# Altium project Pira_Smart_RS485_Addon.PrjPCB
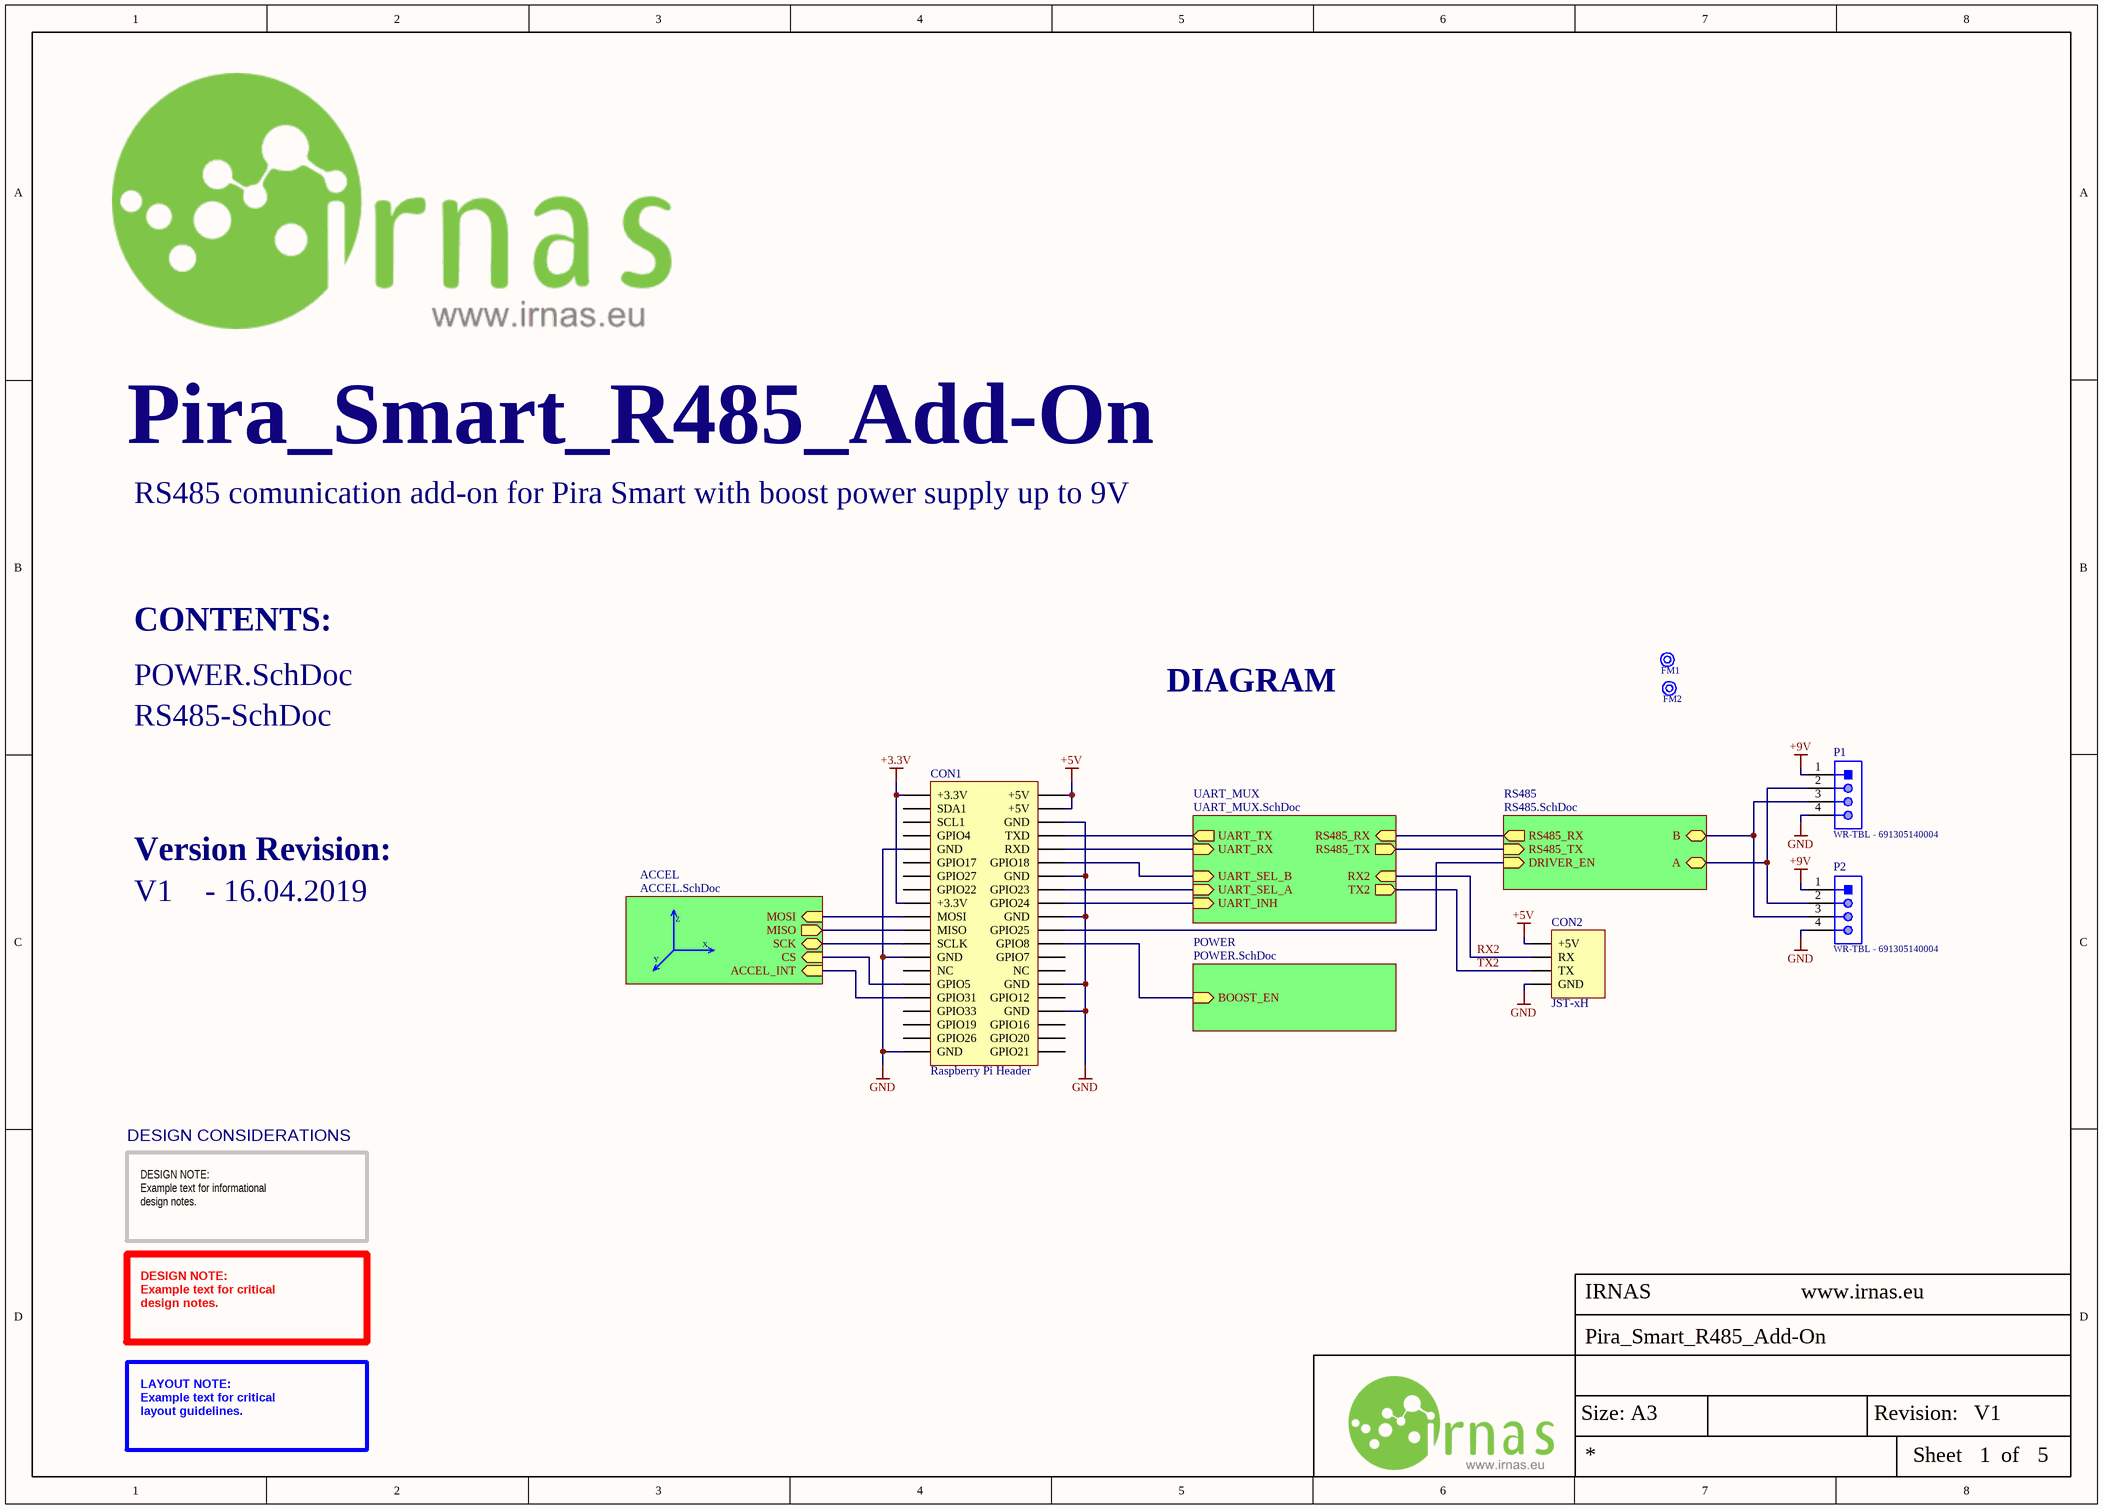
[diagram p0: MAIN.SchDoc]
Company: IRNAS; CreateDate: 16.04.2019; PCBDesigner: Aleksej Cegner; ProjectTitle: Pira_Smart_R485_Add-On; RevisionDate: 16.04.2019; Version: V1; Website: www.irnas.eu
5 sheets, 53 parts. Net scope: hierarchical (ports join the sheet entries above them; power ports are global).
Board file: Pira-Smart-RS485-Addon.PcbDoc
Sheets:
  MAIN.SchDoc
    POWER = POWER.SchDoc
    RS485 = RS485.SchDoc
    UART_MUX = UART_MUX.SchDoc
    ACCEL = ACCEL.SchDoc

## Sheet MAIN.SchDoc
size A3; DocumentNumber: 1; SheetNumber: 1; SheetTotal: 5

### Parts
CON1  Raspberry Pi Header  [HDR2X20]
CON2  JST-xH  [JST-xH]
FM1  FIDUCAL MARKER  [FIDUCAL]  (value not drawn)
FM2  FIDUCAL MARKER  [FIDUCAL]  (value not drawn)
P1  WR-TBL - 691305140004  [691305140004]
P2  WR-TBL - 691305140004  [691305140004]

### Sub-sheets
ACCEL = ACCEL.SchDoc: CS (in), MISO (out), ACCEL_INT (in), SCK (bidir), MOSI (in)
POWER = POWER.SchDoc: BOOST_EN (in)
RS485 = RS485.SchDoc: DRIVER_EN (in), B (bidir), A (bidir), RS485_RX (out), RS485_TX (in)
UART_MUX = UART_MUX.SchDoc: UART_TX (out), UART_SEL_A (in), UART_SEL_B (in), UART_INH (in), RS485_TX (out), RX2 (in), TX2 (out), UART_RX (in), RS485_RX (in)

### Nets
+3.3V: CON1.1(+3.3V) CON1.17(+3.3V)
+5V: CON1.2(+5V) CON1.4(+5V) CON2.1(+5V)
+9V: P1.1 P2.1
GND: CON1.6(GND) CON1.9(GND) CON1.14(GND) CON1.20(GND) CON1.25(GND) CON1.30(GND) CON1.34(GND) CON1.39(GND) CON2.4(GND) P1.4 P2.4
A: P1.2 P2.2 ; sheet RS485/A
ACCEL_INT: CON1.31(GPIO31) ; sheet ACCEL/ACCEL_INT
B: P1.3 P2.3 ; sheet RS485/B
BOOST_EN: CON1.24(GPIO8) ; sheet POWER/BOOST_EN
CS: CON1.29(GPIO5) ; sheet ACCEL/CS
DRIVER_EN: CON1.22(GPIO25) ; sheet RS485/DRIVER_EN
MISO: CON1.21(MISO) ; sheet ACCEL/MISO
MOSI: CON1.19(MOSI) ; sheet ACCEL/MOSI
RS485_RX: sheet RS485/RS485_RX, sheet UART_MUX/RS485_RX
RS485_TX: sheet RS485/RS485_TX, sheet UART_MUX/RS485_TX
RX2: CON2.2(RX) ; sheet UART_MUX/RX2
SCK: CON1.23(SCLK) ; sheet ACCEL/SCK
TX2: CON2.3(TX) ; sheet UART_MUX/TX2
UART_INH: CON1.18(GPIO24) ; sheet UART_MUX/UART_INH
UART_RX: CON1.10(RXD) ; sheet UART_MUX/UART_RX
UART_SEL_A: CON1.16(GPIO23) ; sheet UART_MUX/UART_SEL_A
UART_SEL_B: CON1.12(GPIO18) ; sheet UART_MUX/UART_SEL_B
UART_TX: CON1.8(TXD) ; sheet UART_MUX/UART_TX

Not connected (* = marked no-connect by the designer): CON1 3(SDA1) 5(SCL1) 7(GPIO4) 11(GPIO17) 13(GPIO27) 15(GPIO22) 26(GPIO7) 27(NC) 28(NC) 32(GPIO12) 33(GPIO33) 35(GPIO19) 36(GPIO16) 37(GPIO26) 38(GPIO20) 40(GPIO21)

### Notes on the sheet
- RS485 comunication add-on for Pira Smart with boost power supply up to 9V
- CONTENTS:
- POWER.SchDoc
- DIAGRAM
- RS485-SchDoc
- Version Revision:
- V1    - 16.04.2019
- Z
- Y
- X
- DESIGN CONSIDERATIONS
- DESIGN NOTE:
  Example text for informational
  design notes.
- DESIGN NOTE:
  Example text for critical
  design notes.
- LAYOUT NOTE:
  Example text for critical
  layout guidelines.
- Size: A3
- Revision:
- Sheet
- of

### Library data of the parts
CON1 = Raspberry Pi Header: Header, 20-Pin, Dual row; LatestRevisionDate: 17-Jul-2002; LatestRevisionNote: Re-released for DXP Platform.; Publisher: Altium Limited
CON2 = B4B-XH-A(LF)(SN): 4 Positions Header, Shrouded Connector 0.098" (2.50mm) Through Hole Tin; Manufacturer: JST; No of Positions: 4; Pitch: 2.5 mm; Style/Orientation: Straight Header/Plug; Voltage Rating: 250 V; Current Rating: 3 A; No of Rows: 1; Gender: Male; Mating Type: Detent Lock; Insulation Resistance: 1000 MΩ; Supplier 1: Farnell; Manufacturer Part Number: B4B-XH-A(LF)(SN); Stock 1: 0; Termination: Crimp; Operating Temp Range: -25 to +85 °C; Contact Material: Brass; Contact Plating: Tin; Material: Polyamide; Type: Shrouded Header; Color: Natural; ComponentLink1URL: https://datasheet.ciiva.com/26894/getdatasheetpartid-455616-26894787.pdf; ComponentLink1Description: https://datasheet.ciiva.com/26894/getdatasheetpartid-455616-26894787.pdf; ComponentLink2URL: https://datasheet.ciiva.com/26924/getdatasheetpartid-640571-26924035.pdf; ComponentLink2Description: https://datasheet.ciiva.com/26924/getdatasheetpartid-640571-26924035.pdf; ComponentLink3URL: https://datasheet.ciiva.com/16203/b4b-xh-alfsn-16203642.pdf; ComponentLink3Description: https://datasheet.ciiva.com/16203/b4b-xh-alfsn-16203642.pdf; ComponentLink4URL: https://datasheet.ciiva.com/726/exh-726404.pdf; ComponentLink4Description: https://datasheet.ciiva.com/726/exh-726404.pdf; Supplier Part Number 1: 1516278
FM1 FM2 = FIDUCAL: Komp / Device: SMD; FIT: 0.94; ComponentLink1Description: Datasheet
P1 P2 = WR-TBL - 691305140004: Serie 3051 - 3.50mm Horizontal PCB Header with Plastic Latch WR-TBL, 4 pin; Pin Number: 4; Gender: Male; ComponentLink1Description: Manufacturer; ComponentLink1URL: http://www.we-online.de; ComponentLink2Description: Datasheet; ComponentLink2URL: http://katalog.we-online.de/em/datasheet/691305140004.pdf; Part Number: 691305140004; Published Date: June 2018; Publisher: Wurth Elektronik; Pitch: 3.50 mm; Operating Temperature: -40 to 105 degC; Mounting Technology: THT; Packaging: Box

## Sheet POWER.SchDoc
size A3; DocumentNumber: 2; SheetNumber: 2; SheetTotal: 5
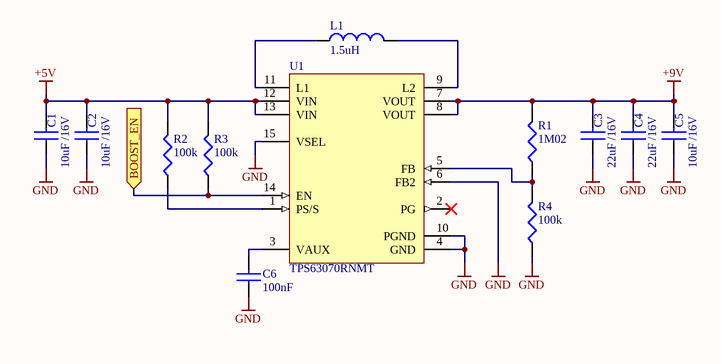
[diagram p1: POWER.SchDoc]

### Parts
C1  10uF /16V  [CAP0805]
C2  10uF /16V  [CAP0805]
C3  22uF /16V  [CAP0805]
C4  22uF /16V  [CAP0805]
C5  10uF /16V  [CAP0805]
C6  100nF  [CAP0603]
L1  1.5uH  [FDSD0402]
R1  1M02  [RES0603]
R2  100k  [RES0603]
R3  100k  [RES0603]
R4  100k  [RES0603]
U1  TPS63070RNMT  [VQFN TPS]

### Ports
BOOST_EN (in)

### Nets
+5V: C1.2 C2.2 R2.2 R3.2 U1.12(VIN) U1.13(VIN)
+9V: C3.2 C4.2 C5.2 R1.2 U1.7(VOUT) U1.8(VOUT)
GND: C1.1 C2.1 C3.1 C4.1 C5.1 C6.1 R4.1 U1.4(GND) U1.6(FB2) U1.10(PGND) U1.15(VSEL)
BOOST_EN: R3.1 U1.14(EN) ; port BOOST_EN
NetC6_2: C6.2 U1.3(VAUX)
NetL1_1: L1.1 U1.11(L1)
NetL1_2: L1.2 U1.9(L2)
NetR1_1: R1.1 R4.2 U1.5(FB)
NetR2_1: R2.1 U1.1(PS/S)

Not connected (* = marked no-connect by the designer): U1 2(PG)*

### Notes on the sheet
- Size: A3
- Revision:
- Sheet
- of

### Library data of the parts
C1 C2 C5 = C - 10uF /16V: TDK - CGA4J1X5R1C106K125AC - CAP, MLCC, X5R, 10UF, 16V, 0805; Supplier 1: Farnell; Manufacturer: TDK; Manufacturer Part Number: CGA4J1X5R1C106K125AC; RoHS: YES; Stock 1: 8974; Pricing 1: 5=0.41, 50=0.146, 250=0.131, 500=0.12, 1000=0.103 (GBP); ComponentLink1URL: http://bcove.me/e1v54mtm; ComponentLink1Description: http://bcove.me/e1v54mtm; ComponentLink2URL: http://www.farnell.com/datasheets/1936565.pdf; ComponentLink2Description: http://www.farnell.com/datasheets/1936565.pdf; ComponentLink3URL: http://www.farnell.com/datasheets/1683658.pdf; ComponentLink3Description: http://www.farnell.com/datasheets/1683658.pdf; Supplier Part Number 1: 2210948RL
C3 C4 = C - 22u 6.3V 0805: MULTICOMP - MC0805X226M6R3CT - CAP, MLCC, X5R, 22UF, 0805; Ceramic Capacitor Case: 0805 [2012 Metric]; Capacitance: 22; Voltage Rating: 6.3; Capacitance Tolerance: ± 20%; Dielectric Characteristic: X5; Product Range: MC Series; SVHC: No SVHC (07-Jul-2017); Capacitor Terminals: SMD; Supplier 1: Farnell; Manufacturer: MULTICOMP; Manufacturer Part Number: MC0805X226M6R3CT; RoHS: YES; Stock 1: 74736; Pricing 1: 5=0.128, 50=0.0738, 250=0.0507, 500=0.042, 1500=0.0358 (GBP); Packaging: Cut Tape; Operating Temperature Min: -55; Operating Temperature Max: 85; Automotive Qualification Standard: -; MSL: -; Capacitance Tolerance ±: ± 20%; Operating Temperature Range: -55°C to +85°C<!--FANDB--><div class="features-and-benefits-container"><div class="features-and-benefits-desc-container"><span class="features-and-benefits-container-desc">SMD Multilayer Ceramic Capacitor, 0805 [2012 Metric], 22 µF, 6.3 V, ± 20%, X5R, MC Series</span></div><div class="features-and-benefits-description"><span class="features-benefits-value">The Multicomp MC series is general purpose MLCC capacitors with X5R dielectric material which provides high electrical precision, stability and reliability. This MLCC capacitor consists of a conducting material and electrodes with high density and high efficiency ceramic condensers.</span></div><div class="features-and-benefits-list"><ul class="features-and-benefits-list-list"><li class="features-and-benefits-list-item">Small size with higher capacitance values</li><li class="features-and-benefits-list-item">0201, 0402, 0603, 0805, 1206, 1210, 1812 case sizes available</li><li class="features-and-benefits-list-item">Capacitance value ranging from 100pF to 220?F</li><li class="features-and-benefits-list-item">Capacitor with lead free termination (pure Tin)</li><li class="features-and-benefits-list-item">High electrical precision, stability and reliability</li><li class="features-and-benefits-list-item">Rated voltage of 4V, 6.3V, 10V, 16V, 25V, 50V</li><li class="features-and-benefits-list-item">Operating temperature of -55°C to +85°C</li><li class="features-and-benefits-list-item">Available in ±10% and ±20; ComponentLink1URL: http://www.farnell.com/datasheets/1901289.pdf; ComponentLink1Description: http://www.farnell.com/datasheets/1901289.pdf; ComponentLink2URL: http://www.farnell.com/datasheets/1932399.pdf; ComponentLink2Description: http://www.farnell.com/datasheets/1932399.pdf; Supplier Part Number 1: 1759415
C6 = C - 100nF: MURATA - GRM188R71C104KA01J - CAP, MLCC, X7R, 0.1UF, 16V, 0603; IRNAS Part No.: I-200005; Ceramic Capacitor Case: 0603 [1608 Metric]; Capacitance: 0.1; Voltage Rating: 16; Capacitance Tolerance: ± 10%; Dielectric Characteristic: X7; Product Range: GRM Series; SVHC: No SVHC (20-Jun-2016; Supplier 1: Farnell; Manufacturer: MURATA; Manufacturer Part Number: GRM188R71C104KA01J; RoHS: YES; Stock 1: 18297; Pricing 1: 10=0.0145, 100=0.0126, 500=0.0081, 2500=0.0059, 5000=0.0052, 10000=0.0046, 50000=0.0036, 100000=0.0035 (GBP); Packaging: Cut Tape; Operating Temperature Min: -55; Operating Temperature Max: 125; Automotive Qualification Standard: -; MSL: MSL 1 - Unlimited; ComponentLink1URL: http://www.farnell.com/datasheets/2189124.pdf; ComponentLink1Description: http://www.farnell.com/datasheets/2189124.pdf; Supplier Part Number 1: 2688519
L1 = L - 1.5uH 5.1A: MURATA - FDSD0420-H-1R5M=P3 - INDUCTOR, SHIELDED, 1.5UH, 5.1A, 20%; Product Range: FDSD0420 Series; Inductance: 1.5; RMS Current (Irms): 5.1; Saturation Current (Isat): 7.7; DC Resistance Max: 0.036; Power Inductor Case: 4.2mm x 4.2mm x 2; SVHC: No SVHC (17-Dec-2015); Supplier 1: Farnell; Manufacturer: MURATA; Manufacturer Part Number: FDSD0420-H-1R5M=P3; RoHS: YES; Stock 1: 1471; Pricing 1: 5=0.79, 50=0.448, 250=0.422, 500=0.377, 1000=0.305, 2000=0.298, 10000=0.291, 20000=0.284 (GBP); Inductor Construction: Shielded; Inductance Tolerance: ± 20%; Packaging: Each; MSL: MSL 1 - Unlimited<!--FANDB--><div class="features-and-benefits-container"></div>; ComponentLink1URL: http://www.farnell.com/datasheets/2021980.pdf; ComponentLink1Description: http://www.farnell.com/datasheets/2021980.pdf; Supplier Part Number 1: 2530091
R1 = R - 100k: MULTICOMP - MCMR06X104 JTL - RES, CERAMIC, 1M02, 1%, 0.1W, 0603; Resistance: 100; Voltage Rating: 75; Resistor Case Style: 0603 [1608 Metric]; Product Range: MCMR Series; Temperature Coefficient: ± 100; Resistor Mounting: Surface Mount Device<!--FANDB--><div class="features-and-benefits-container"><div class="features-and-benefits-description"><span class="features-benefits-value">The Multicomp MCMR series resistors are automotive grade, anti sulphured thick film chip resistor. The resistance range includes E24 and E96 decade values from 1ohm to 10Mohm. These resistors are constructed on top of a high grade ceramic body.</span></div><div class="features-and-benefits-list"><ul class="features-and-benefits-list-list"><li class="features-and-benefits-list-item">EIA 0402, 0603, 0805, 1206 chip sizes available</li><li class="features-and-benefits-list-item">High reliability and stability</li><li class="features-and-benefits-list-item">Automotive grade AEC-Q200 compliant</li><li class="features-and-benefits-list-item">Complaint with (IEC 60068-1) 55/155/56 climatic category</li><li class="features-and-benefits-list-item">Maximum operation voltage of 50V, 75V, 150V and 200V</li><li class="features-and-benefits-list-item">Power rating of 62.5mW, 100mW, 125mW and 250mW</li><li class="features-and-benefits-list-item">Available in ±1% and ±5% tolerance</li><li class="features-and-benefits-list-item">Temperature coefficient (TCR) of +200ppm/°C, +100ppm/°C and -200ppm/°C to +400ppm/°C</li><li class="features-and-benefits-list-item">Operating temperature range -55°C to 155; Supplier 1: Farnell; Manufacturer: MULTICOMP; Manufacturer Part Number: MCMR06X104 JTL; RoHS: Y-EX; Stock 1: 187; Pricing 1: 10=0.0109, 100=0.0085, 500=0.006, 1000=0.0048, 2500=0.004, 5000=0.003, 25000=0.002, 50000=0.0016 (GBP); Power Rating: 100; Resistance Tolerance: ± 1%; Packaging: Cut Tape; Resistor Element Material: Ceramic; Automotive Qualification Standard: -; ComponentLink1URL: http://www.farnell.com/datasheets/1716707.pdf; ComponentLink1Description: http://www.farnell.com/datasheets/1716707.pdf; Supplier Part Number 1: 2073357
R2 R3 = R - 100k: MULTICOMP - MCMR06X104 JTL - RES, CERAMIC, 100K, 5%, 0.1W, 0603; Resistance: 100; Voltage Rating: 75; Resistor Case Style: 0603 [1608 Metric]; Product Range: MCMR Series; Temperature Coefficient: ± 100; Resistor Mounting: Surface Mount Device<!--FANDB--><div class="features-and-benefits-container"><div class="features-and-benefits-description"><span class="features-benefits-value">The Multicomp MCMR series resistors are automotive grade, anti sulphured thick film chip resistor. The resistance range includes E24 and E96 decade values from 1ohm to 10Mohm. These resistors are constructed on top of a high grade ceramic body.</span></div><div class="features-and-benefits-list"><ul class="features-and-benefits-list-list"><li class="features-and-benefits-list-item">EIA 0402, 0603, 0805, 1206 chip sizes available</li><li class="features-and-benefits-list-item">High reliability and stability</li><li class="features-and-benefits-list-item">Automotive grade AEC-Q200 compliant</li><li class="features-and-benefits-list-item">Complaint with (IEC 60068-1) 55/155/56 climatic category</li><li class="features-and-benefits-list-item">Maximum operation voltage of 50V, 75V, 150V and 200V</li><li class="features-and-benefits-list-item">Power rating of 62.5mW, 100mW, 125mW and 250mW</li><li class="features-and-benefits-list-item">Available in ±1% and ±5% tolerance</li><li class="features-and-benefits-list-item">Temperature coefficient (TCR) of +200ppm/°C, +100ppm/°C and -200ppm/°C to +400ppm/°C</li><li class="features-and-benefits-list-item">Operating temperature range -55°C to 155; Supplier 1: Farnell; Manufacturer: MULTICOMP; Manufacturer Part Number: MCMR06X104 JTL; RoHS: Y-EX; Stock 1: 187; Pricing 1: 10=0.0109, 100=0.0085, 500=0.006, 1000=0.0048, 2500=0.004, 5000=0.003, 25000=0.002, 50000=0.0016 (GBP); Power Rating: 100; Resistance Tolerance: ± 5%; Packaging: Cut Tape; Resistor Element Material: Ceramic; Automotive Qualification Standard: -; ComponentLink1URL: http://www.farnell.com/datasheets/1716707.pdf; ComponentLink1Description: http://www.farnell.com/datasheets/1716707.pdf; Supplier Part Number 1: 2073357
R4 = R - 100k: MULTICOMP - MCMR06X104 JTL - RES, CERAMIC, 100K, 1%, 0.1W, 0603; Resistance: 100; Voltage Rating: 75; Resistor Case Style: 0603 [1608 Metric]; Product Range: MCMR Series; Temperature Coefficient: ± 100; Resistor Mounting: Surface Mount Device<!--FANDB--><div class="features-and-benefits-container"><div class="features-and-benefits-description"><span class="features-benefits-value">The Multicomp MCMR series resistors are automotive grade, anti sulphured thick film chip resistor. The resistance range includes E24 and E96 decade values from 1ohm to 10Mohm. These resistors are constructed on top of a high grade ceramic body.</span></div><div class="features-and-benefits-list"><ul class="features-and-benefits-list-list"><li class="features-and-benefits-list-item">EIA 0402, 0603, 0805, 1206 chip sizes available</li><li class="features-and-benefits-list-item">High reliability and stability</li><li class="features-and-benefits-list-item">Automotive grade AEC-Q200 compliant</li><li class="features-and-benefits-list-item">Complaint with (IEC 60068-1) 55/155/56 climatic category</li><li class="features-and-benefits-list-item">Maximum operation voltage of 50V, 75V, 150V and 200V</li><li class="features-and-benefits-list-item">Power rating of 62.5mW, 100mW, 125mW and 250mW</li><li class="features-and-benefits-list-item">Available in ±1% and ±5% tolerance</li><li class="features-and-benefits-list-item">Temperature coefficient (TCR) of +200ppm/°C, +100ppm/°C and -200ppm/°C to +400ppm/°C</li><li class="features-and-benefits-list-item">Operating temperature range -55°C to 155; Supplier 1: Farnell; Manufacturer: MULTICOMP; Manufacturer Part Number: MCMR06X104 JTL; RoHS: Y-EX; Stock 1: 187; Pricing 1: 10=0.0109, 100=0.0085, 500=0.006, 1000=0.0048, 2500=0.004, 5000=0.003, 25000=0.002, 50000=0.0016 (GBP); Power Rating: 100; Resistance Tolerance: ± 1%; Packaging: Cut Tape; Resistor Element Material: Ceramic; Automotive Qualification Standard: -; ComponentLink1URL: http://www.farnell.com/datasheets/1716707.pdf; ComponentLink1Description: http://www.farnell.com/datasheets/1716707.pdf; Supplier Part Number 1: 2073357
U1 = V_SW - TPS63070RNMT: TEXAS INSTRUMENTS - TPS63070RNMT - DC/DC CONV, BUCK-BOOST, 2.4MHZ, VQFN-15; Input Voltage Min: 2; Input Voltage Max: 16; DC / DC Converter IC Case: VQFN; No. of Pins: 15; Output Voltage Nom.: 5; Switching Frequency: 2.4; SVHC: No SVHC (17-Dec-2015; Manufacturer: TEXAS INSTRUMENTS; Manufacturer Part Number: TPS63070RNMT; RoHS: YES; Stock 1: 456; Pricing 1: 1=2.23, 10=1.87, 100=1.7, 250=1.56, 500=1.47, 1000=1.21 (GBP); Topology: Buck-Boost; Output Current: 2; Operating Temperature Max: 125; Packaging: Cut Tape; Product Range: -; Automotive Qualification Standard: -; MSL: MSL 1 - Unlimited; ComponentLink1URL: http://www.ti.com/general/docs/lit/getliterature.tsp?genericPartNumber=TPS63070&fileType=pdf; ComponentLink1Description: http://www.ti.com/general/docs/lit/getliterature.tsp?genericPartNumber=TPS63070&fileType=pdf; Supplier 1: Mouser; Supplier Part Number 1: 595-TPS63070RNMR

## Sheet RS485.SchDoc
size A3; DocumentNumber: 3; SheetNumber: 3; SheetTotal: 5
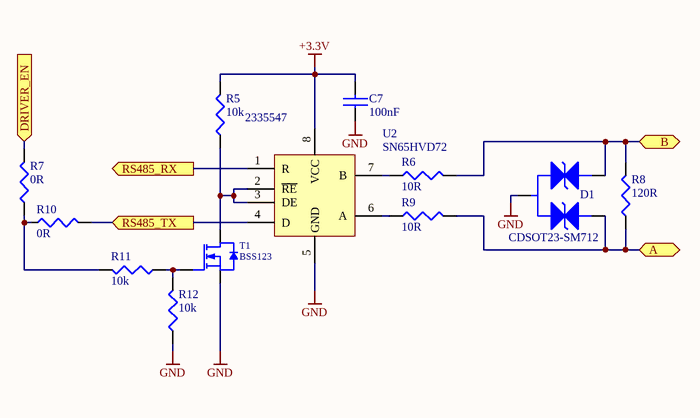
[diagram p2: RS485.SchDoc]

### Parts
C7  100nF  [CAP0603]
D1  CDSOT23-SM712  [SOT23-3AL]
R5  10k  [RES0603]
R6  10R  [RES0603]
R7  0R  [RES0603]
R8  120R  [RES0603]
R9  10R  [RES0603]
R10  0R  [RES0603]
R11  10k  [RES0603]
R12  10k  [RES0603]
T1  BSS123  [SOT23-3AL]
U2  SN65HVD72  Supplier Part Number 1: 2335547  [SOIC-8 REFLOW]

### Ports
A (bidir), B (bidir), DRIVER_EN (in), RS485_RX (out), RS485_TX (in)

### Nets
+3.3V: C7.2 R5.2 U2.8(VCC)
GND: C7.1 D1.3(ANODE) R12.1 T1.2(S) U2.5(GND)
A: D1.2(cathode) R8.1 R9.2 ; port A
B: D1.1(cathode) R6.2 R8.2 ; port B
DRIVER_EN: R7.2 ; port DRIVER_EN
RS485_RX: U2.1(R) ; port RS485_RX
RS485_TX: R10.2 U2.4(D) ; port RS485_TX
NetR5_1: R5.1 T1.3(D) U2.2(~{RE}) U2.3(DE)
NetR6_1: R6.1 U2.7(B)
NetR7_1: R7.1 R10.1 R11.2
NetR9_1: R9.1 U2.6(A)
NetR11_1: R11.1 R12.2 T1.1(G)

### Notes on the sheet
- Size: A3
- Revision:
- Sheet
- of

### Library data of the parts
C7 = C - 100nF: as C6 on sheet POWER; Supplier 1: Farnell; Manufacturer: MURATA; Manufacturer Part Number: GRM188R71C104KA01J; RoHS: YES; Stock 1: 18297; Pricing 1: 10=0.0145, 100=0.0126, 500=0.0081, 2500=0.0059, 5000=0.0052, 10000=0.0046, 50000=0.0036, 100000=0.0035 (GBP); Packaging: Cut Tape; Operating Temperature Min: -55; Operating Temperature Max: 125; Automotive Qualification Standard: -; MSL: MSL 1 - Unlimited; ComponentLink1URL: http://www.farnell.com/datasheets/2189124.pdf; ComponentLink1Description: http://www.farnell.com/datasheets/2189124.pdf; Supplier Part Number 1: 2688519
D1 = D_TVS - CDSOT23-SM712: TVS Diode, CDSOT23 Series, Bidirectional, 12 V, 26 V, SOT-23, 3 Pins; Manufacturer: DIODES INC.; Manufacturer Part Number: 1N4148W-7-F.; Diode Configuration: Single; Repetitive Reverse Voltage Vrrm Max: 100; Forward Current If(AV): 300; Forward Voltage VF Max: 1.25; Reverse Recovery Time trr Max: 4; Forward Surge Current Ifsm Max: 2; Diode Case Style: SOD-123; Product Range: 1N4148 Series; SVHC: No SVHC (17-Dec-2015); Diode Type: Switching; Supplier 1: Farnell; RoHS: YES; Stock 1: 157320; Pricing 1: 1=0.136, 25=0.132, 100=0.0465, 500=0.042, 1000=0.024, 3000=0.021, 9000=0.017, 30000=0.0149 (GBP); Operating Temperature Max: 150; No. of Pins: 2; Packaging: Cut Tape; Automotive Qualification Standard: -; MSL: MSL 1 - Unlimited; Operating Temperature Min: -65; Operating Temperature Range: -65°C to +150°C<!--FANDB--><div class="features-and-benefits-container"><div class="features-and-benefits-description"><span class="features-benefits-value">The 1N4148W-7-F is a surface mount fast Switching Diode with moulded plastic case. Suitable for general purpose switching applications.</span></div><div class="features-and-benefits-list"><ul class="features-and-benefits-list-list"><li class="features-and-benefits-list-item">Fast Switching Speed</li><li class="features-and-benefits-list-item">2; ComponentLink1URL: http://www.farnell.com/datasheets/2238378.pdf; ComponentLink1Description: http://www.farnell.com/datasheets/2238378.pdf; Supplier Part Number 1: 1776392
R5 R11 R12 = R - 10k: MULTICOMP - MCMR06X103 JTL - RES, CERAMIC, 10K, 5%, 0.1W, 0603; IRNAS Part No.: I-100008; Resistance: 10; Voltage Rating: 75; Resistor Case Style: 0603 [1608 Metric]; Power Rating: 100; Product Range: MCMR Series; Temperature Coefficient: ± 100; Automotive Qualification Standard: -<!--FANDB--><div class="features-and-benefits-container"><div class="features-and-benefits-description"><span class="features-benefits-value">The Multicomp MCMR series resistors are automotive grade, anti sulphured thick film chip resistor. The resistance range includes E24 and E96 decade values from 1ohm to 10Mohm. These resistors are constructed on top of a high grade ceramic body.</span></div><div class="features-and-benefits-list"><ul class="features-and-benefits-list-list"><li class="features-and-benefits-list-item">EIA 0402, 0603, 0805, 1206 chip sizes available</li><li class="features-and-benefits-list-item">High reliability and stability</li><li class="features-and-benefits-list-item">Automotive grade AEC-Q200 compliant</li><li class="features-and-benefits-list-item">Complaint with (IEC 60068-1) 55/155/56 climatic category</li><li class="features-and-benefits-list-item">Maximum operation voltage of 50V, 75V, 150V and 200V</li><li class="features-and-benefits-list-item">Power rating of 62.5mW, 100mW, 125mW and 250mW</li><li class="features-and-benefits-list-item">Available in ±1% and ±5% tolerance</li><li class="features-and-benefits-list-item">Temperature coefficient (TCR) of +200ppm/°C, +100ppm/°C and -200ppm/°C to +400ppm/°C</li><li class="features-and-benefits-list-item">Operating temperature range -55°C to 155; Supplier 1: Farnell; Manufacturer: MULTICOMP; Manufacturer Part Number: MCMR06X103 JTL; RoHS: Y-EX; Stock 1: 19791; Pricing 1: 10=0.0087, 100=0.0074, 500=0.0061, 1000=0.0048, 2500=0.0032, 5000=0.0024, 25000=0.0016, 50000=0.0013 (GBP); Resistance Tolerance: ± 5%; Packaging: Cut Tape; Resistor Element Material: Ceramic; ComponentLink1URL: http://www.farnell.com/datasheets/1716707.pdf; ComponentLink1Description: http://www.farnell.com/datasheets/1716707.pdf; Supplier Part Number 1: 2073356
R6 R9 = R - 10R: VISHAY - RCA060310R0FKEA - RES, AUTO, THICK FILM, 10R, 1%, 0603; IRNAS Part No.: I-100010; Resistance: 10; Voltage Rating: 75; Resistor Case Style: 0603 [1608 Metric]; Power Rating: 100; Product Range: RCA Series; Temperature Coefficient: ± 100; Automotive Qualification Standard: AEC-Q200; SVHC: No SVHC (17-Dec-2015)<!--FANDB--><div class="features-and-benefits-container"><div class="features-and-benefits-description"><span class="features-benefits-value">The RCA series from Vishay are automotive grade, sulphur resistant thick film rectangular chip resistors. The resistance range includes E24 and E96 decade values from 1ohm to 10Mohm. They provide superior resistance against H2S atmosphere. These resistors have metal glaze on high quality ceramic.</span></div><div class="features-and-benefits-list"><ul class="features-and-benefits-list-list"><li class="features-and-benefits-list-item">Automotive grade AEC-Q200 qualified (rev C)</li><li class="features-and-benefits-list-item">EIA 0402, 0603, 0805, 1206, 1210, 1218, 2010 and 2512 case sizes available</li><li class="features-and-benefits-list-item">Available in ±0.5%, ±1% and ±5% tolerances</li><li class="features-and-benefits-list-item">Jumpers are also available</li><li class="features-and-benefits-list-item">±50ppm/K, ±100ppm/K and ±200ppm/K TCR values</li><li class="features-and-benefits-list-item">Power rating of 0.063W, 0.10W, 0.125W, 0.25W, 0.5W, 0.75W and 1W at 70?C</li><li class="features-and-benefits-list-item">Available in 50V, 75V, 150V, 200V, 400V and 500V limiting voltage options</li><li class="features-and-benefits-list-item">Category temperature range from -55?C to 155?C</li><li class="features-and-benefits-list-item">Stability ?R/R = 1 % for 1000h at 70; Supplier 1: Farnell; Manufacturer: VISHAY; Manufacturer Part Number: RCA060310R0FKEA; RoHS: YES; Stock 1: 9559; Pricing 1: 10=0.0803, 100=0.0386, 500=0.0235, 2500=0.015, 5000=0.0135, 10000=0.0108, 50000=0.0068, 100000=0.0067 (GBP); Resistance Tolerance: ± 1%; Packaging: Cut Tape; Resistor Element Material: Thick Film; ComponentLink1URL: http://www.farnell.com/datasheets/2111201.pdf; ComponentLink1Description: http://www.farnell.com/datasheets/2111201.pdf; Supplier Part Number 1: 2616585
R7 R10 = R - 0R: BOURNS - CR0603-J/-000ELF - RES, THICK FILM, 0R, 5%, 0.1W, 0603; IRNAS Part No.: I-100011; Resistance: 0; Voltage Rating: 50; Resistor Case Style: 0603 [1608 Metric]; Power Rating: 100; Product Range: CR Series; SVHC: No SVHC (17-Dec-2015); Resistor Mounting: Surface Mount Device<!--FANDB--><div class="features-and-benefits-container"><div class="features-and-benefits-description"><span class="features-benefits-value">The Bourns CR series are standard thick film chip resistors. These resistors provide flexibility of performance, space saving and low cost. The Resistance range includes E96 and E24 decade values from 1ohm to 10Mohm.</span></div><div class="features-and-benefits-list"><ul class="features-and-benefits-list-list"><li class="features-and-benefits-list-item">0201, 0402, 0603, 0805, 1206, 1210, 2010, 2512 standard case sizes available</li><li class="features-and-benefits-list-item">±1% and ±5% tolerance</li><li class="features-and-benefits-list-item">±100ppm/°C, ±200ppm/°C and ±250ppm/°C TCR values available</li><li class="features-and-benefits-list-item">Power rating selectable for 50mW, 63mW, 0.1W, 0.125W, 0.25W, 0.5W and 1W based on ordering</li><li class="features-and-benefits-list-item">Jumpers are available for all size</li><li class="features-and-benefits-list-item">3 layer termination process with nickel barrier prevents leaching & provides excellent solderability</li><li class="features-and-benefits-list-item">Suitable for all type of soldering processes</li><li class="features-and-benefits-list-item">Tight dimensional tolerances</li><li class="features-and-benefits-list-item">Maximum working voltage depends on case size</li><li class="features-and-benefits-list-item">Operating temperature of -55°C to +125°C(CR0201) and -55°C to +155; Supplier 1: Farnell; Manufacturer: BOURNS; Manufacturer Part Number: CR0603-J/-000ELF; RoHS: YES; Stock 1: 58200; Pricing 1: 10=0.0146, 250=0.0097, 1000=0.0073, 5000=0.0049, 12500=0.0042 (GBP); Resistance Tolerance: ± 5%; Packaging: Cut Tape; Resistor Element Material: Thick Film; Temperature Coefficient: -; Automotive Qualification Standard: -; MSL: MSL 1 - Unlimited; ComponentLink1URL: http://www.bourns.com/engineering/CHPREZTR/cr0603.stp; ComponentLink1Description: http://www.bourns.com/engineering/CHPREZTR/cr0603.stp; ComponentLink2URL: http://www.farnell.com/datasheets/2178762.pdf; ComponentLink2Description: http://www.farnell.com/datasheets/2178762.pdf; Supplier Part Number 1: 2008343
R8 = R - 120R: RES SMD 120 OHM 1% 1/4W 0603; Manufacturer: Vishay; Manufacturer Part Number: CRCW0603120RFKEAHP; Voltage Rating: 75V; Power Rating: 250mW; Temperature Coefficient: 100ppm/°C; Supplier 1: Farnell; Stock 1: 34760; Pricing 1: 10=0.141, 100=0.0937, 500=0.0669, 1000=0.0453 (EUR); Case/Package: 0603; Contact Plating: Tin; Case Code (Metric): 1608; Case Code (Imperial): 0603; Min Operating Temperature: -55°C; Max Operating Temperature: 155°C; Package Quantity: 5000; Packaging: Tape and Reel; Termination: SMD/SMT; Resistance: 120R; Tolerance: 1%; Composition: Thick Film; Number of Terminations: 2; Military Standard: Not; Max Power Dissipation: 250mW; Features: Automotive AEC-Q200; Length: 1.6mm; Height: 0.022inch; Width: 0.033inch; Depth: 0.85mm; Radiation Hardening: No; REACH SVHC: Unknown; ComponentLink1URL: https://datasheet.ciiva.com/5852/424479-5852064.pdf; ComponentLink1Description: https://datasheet.ciiva.com/5852/424479-5852064.pdf; ComponentLink2URL: https://datasheet.ciiva.com/2578/crcwhpe3-2578529.pdf; ComponentLink2Description: https://datasheet.ciiva.com/2578/crcwhpe3-2578529.pdf; ComponentLink3URL: https://datasheet.ciiva.com/8975/crcwhpe3-8975275.pdf; ComponentLink3Description: https://datasheet.ciiva.com/8975/crcwhpe3-8975275.pdf; ComponentLink4URL: https://datasheet.ciiva.com/7777/424479-7777277.pdf; ComponentLink4Description: https://datasheet.ciiva.com/7777/424479-7777277.pdf; ComponentLink5URL: https://datasheet.ciiva.com/7777/424479-7777278.pdf; ComponentLink5Description: https://datasheet.ciiva.com/7777/424479-7777278.pdf; Supplier Part Number 1: 1738892
T1 = T_M - BSS123: N-Channel Vds = 100V, Id = 170 mA; Opis / Description: MOSFET BSS123       /N-Channel; Komp / Device: SMD; Value: BSS128W; Velikost / Size: SOT23; ComponentLink1Description: Datasheet; ComponentLink1URL: C:\ELRADSVN\Altium_Library\Libraries\Active\Datasheet\BSS138BKW.pdf; Date: 11.07.2018; Supplier 1: Farnell; Supplier Part Number 1: 9845321
U2 = INT - SN65HVD72: Supplier 1: Farnell

## Sheet UART_MUX.SchDoc
size A3; DocumentNumber: 4; SheetNumber: 4; SheetTotal: 5
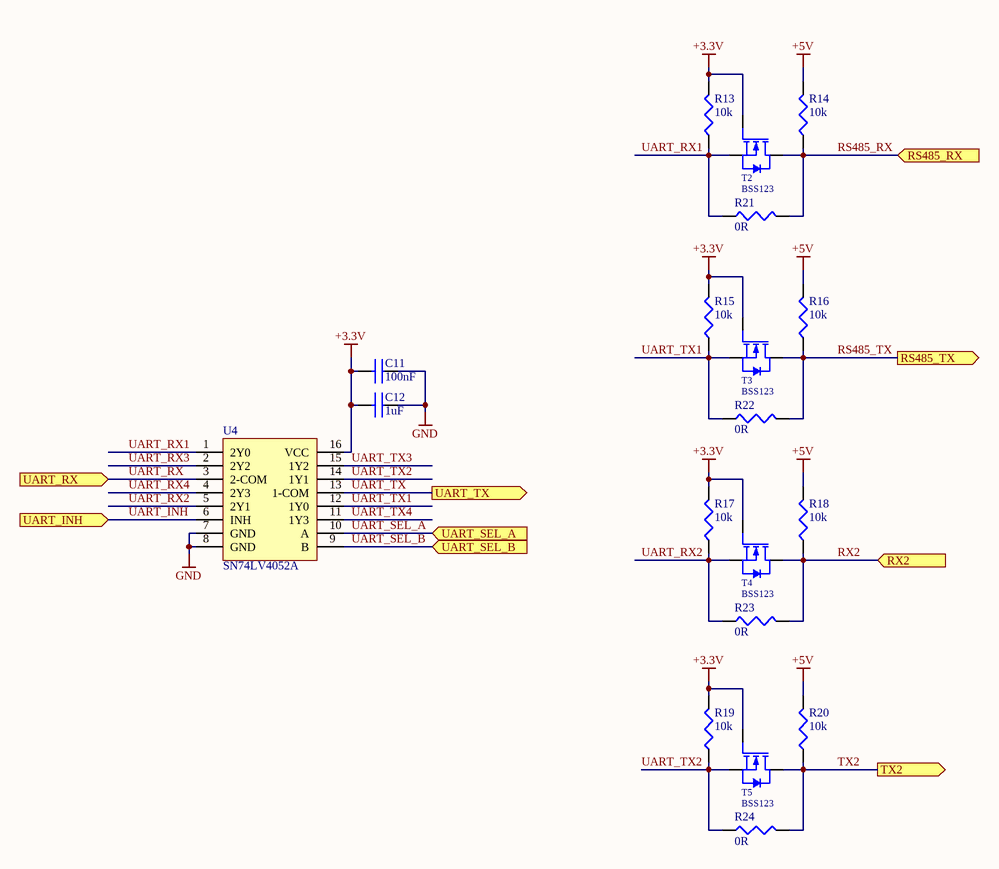
[diagram p3: UART_MUX.SchDoc]

### Parts
C11  100nF  [CAP0603]
C12  1uF  [CAP0603]
R13  10k  [RES0603]
R14  10k  [RES0603]
R15  10k  [RES0603]
R16  10k  [RES0603]
R17  10k  [RES0603]
R18  10k  [RES0603]
R19  10k  [RES0603]
R20  10k  [RES0603]
R21  0R  [RES0603]
R22  0R  [RES0603]
R23  0R  [RES0603]
R24  0R  [RES0603]
T2  BSS123  [SOT23-3AL]
T3  BSS123  [SOT23-3AL]
T4  BSS123  [SOT23-3AL]
T5  BSS123  [SOT23-3AL]
U4  SN74LV4052A  [SOIC-16]

### Ports
RS485_RX (in), RS485_TX (out), RX2 (in), TX2 (out), UART_INH (in), UART_RX (in), UART_SEL_A (in), UART_SEL_B (in), UART_TX (out)

### Nets
+3.3V: C11.2 C12.2 R13.2 R15.2 R17.2 R19.2 T2.1(G) T3.1(G) T4.1(G) T5.1(G) U4.16(VCC)
+5V: R14.2 R16.2 R18.2 R20.2
GND: C11.1 C12.1 U4.7(GND) U4.8(GND)
RS485_RX: R14.1 R21.2 T2.3(D) ; port RS485_RX
RS485_TX: R16.1 R22.2 T3.3(D) ; port RS485_TX
RX2: R18.1 R23.2 T4.3(D) ; port RX2
TX2: R20.1 R24.2 T5.3(D) ; port TX2
UART_INH: U4.6(INH) ; port UART_INH
UART_RX: U4.3(2-COM) ; port UART_RX
UART_RX1: R13.1 R21.1 T2.2(S) U4.1(2Y0)
UART_RX2: R17.1 R23.1 T4.2(S) U4.5(2Y1)
UART_RX3: U4.2(2Y2)
UART_RX4: U4.4(2Y3)
UART_SEL_A: U4.10(A) ; port UART_SEL_A
UART_SEL_B: U4.9(B) ; port UART_SEL_B
UART_TX: U4.13(1-COM) ; port UART_TX
UART_TX1: R15.1 R22.1 T3.2(S) U4.12(1Y0)
UART_TX2: R19.1 R24.1 T5.2(S) U4.14(1Y1)
UART_TX3: U4.15(1Y2)
UART_TX4: U4.11(1Y3)

### Notes on the sheet
- Size: A3
- Revision:
- Sheet
- of

### Library data of the parts
C11 = C - 100nF: as C6 on sheet POWER; Supplier 1: Farnell; Manufacturer: MURATA; Manufacturer Part Number: GRM188R71C104KA01J; RoHS: YES; Stock 1: 18297; Pricing 1: 10=0.0145, 100=0.0126, 500=0.0081, 2500=0.0059, 5000=0.0052, 10000=0.0046, 50000=0.0036, 100000=0.0035 (GBP); Packaging: Cut Tape; Operating Temperature Min: -55; Operating Temperature Max: 125; Automotive Qualification Standard: -; MSL: MSL 1 - Unlimited; ComponentLink1URL: http://www.farnell.com/datasheets/2189124.pdf; ComponentLink1Description: http://www.farnell.com/datasheets/2189124.pdf; Supplier Part Number 1: 2688519
C12 = C - 1uF: MURATA - GRM188R61H105KAALD - CAP, MLCC, X5R, 1UF, 50V, 0603; IRNAS Part No.: I-200006; Ceramic Capacitor Case: 0603 [1608 Metric]; Capacitance: 1; Voltage Rating: 50; Capacitance Tolerance: ± 10%; Dielectric Characteristic: X5; Product Range: GRM Series; SVHC: No SVHC (17-Dec-2015); Capacitor Terminals: SMD<!--FANDB--><div class="features-and-benefits-container"><div class="features-and-benefits-description"><span class="features-benefits-value">The Murata GRM series capacitors are Multilayer Ceramic Chip Capacitors (MLCC) used for general purpose applications. These MLCC capacitors are classified into temperature compensating and high dielectric constant types depending on the change in electrostatic capacitance due to change in temperature. The temperature compensating capacitors feature a small rate of change in electrostatic capacitance as the temperature changes and are used for applications such as filters and high frequency circuit matching. The high dielectric constant capacitors use materials with a high dielectric constant and feature a large electrostatic capacitance. Typical applications are power supply decoupling and smoothing circuits.</span></div><div class="features-and-benefits-list"><ul class="features-and-benefits-list-list"><li class="features-and-benefits-list-item">Large capacity and small size in a multilayer structure</li><li class="features-and-benefits-list-item">Capacitance value ranging from 0.1pF to 220?F</li><li class="features-and-benefits-list-item">Tin plated external electrodes, excellent solderability</li><li class="features-and-benefits-list-item">Provides good high frequency characteristics</li><li class="features-and-benefits-list-item">Excellent pulse response</li><li class="features-and-benefits-list-item">High reliability</li><li class="features-and-benefits-list-item">Capacitor size varies from 0.4×0.2mm to 5.7×5.0mm</li><li class="features-and-benefits-list-item">Rated voltage of 2.5VDC to 3.15; Supplier 1: Farnell; Manufacturer: MURATA; Manufacturer Part Number: GRM188R61H105KAALD; RoHS: YES; Stock 1: 62682; Pricing 1: 10=0.093, 100=0.062, 500=0.0507, 1000=0.0465, 2000=0.0429, 4000=0.0399, 20000=0.0372, 40000=0.0365 (GBP); Packaging: Cut Tape; Operating Temperature Min: -55; Operating Temperature Max: 85; Automotive Qualification Standard: -; MSL: -; Capacitance Tolerance ±: ± 10%; ComponentLink1URL: http://www.farnell.com/datasheets/2048611.pdf; ComponentLink1Description: http://www.farnell.com/datasheets/2048611.pdf; Supplier Part Number 1: 1845736
R13-R20 = R - 10k: as R5 on sheet RS485; Supplier 1: Farnell; Manufacturer: MULTICOMP; Manufacturer Part Number: MCMR06X103 JTL; RoHS: Y-EX; Stock 1: 19791; Pricing 1: 10=0.0087, 100=0.0074, 500=0.0061, 1000=0.0048, 2500=0.0032, 5000=0.0024, 25000=0.0016, 50000=0.0013 (GBP); Resistance Tolerance: ± 5%; Packaging: Cut Tape; Resistor Element Material: Ceramic; ComponentLink1URL: http://www.farnell.com/datasheets/1716707.pdf; ComponentLink1Description: http://www.farnell.com/datasheets/1716707.pdf; Supplier Part Number 1: 2073356
R21-R24 = R - 0R: as R7 on sheet RS485; Supplier 1: Farnell; Manufacturer: BOURNS; Manufacturer Part Number: CR0603-J/-000ELF; RoHS: YES; Stock 1: 58200; Pricing 1: 10=0.0146, 250=0.0097, 1000=0.0073, 5000=0.0049, 12500=0.0042 (GBP); Resistance Tolerance: ± 5%; Packaging: Cut Tape; Resistor Element Material: Thick Film; Temperature Coefficient: -; Automotive Qualification Standard: -; MSL: MSL 1 - Unlimited; ComponentLink1URL: http://www.bourns.com/engineering/CHPREZTR/cr0603.stp; ComponentLink1Description: http://www.bourns.com/engineering/CHPREZTR/cr0603.stp; ComponentLink2URL: http://www.farnell.com/datasheets/2178762.pdf; ComponentLink2Description: http://www.farnell.com/datasheets/2178762.pdf; Supplier Part Number 1: 2008343
T2-T5 = T_M - BSS123: as T1 on sheet RS485; ComponentLink1Description: Datasheet; ComponentLink1URL: C:\ELRADSVN\Altium_Library\Libraries\Active\Datasheet\BSS138BKW.pdf; Date: 11.07.2018; Supplier 1: Farnell; Supplier Part Number 1: 9845321
U4 = INT - SN74LV4052A: Analog Multiplexer/Demultiplexer, 4:1, 2 Circuits, 100ohm, 2V to 5.5V Supply, SOIC-16; Supplier 1: Farnell; Supplier Part Number 1: 2854627

## Sheet ACCEL.SchDoc
size A3; DocumentNumber: 5; SheetNumber: 5; SheetTotal: 5
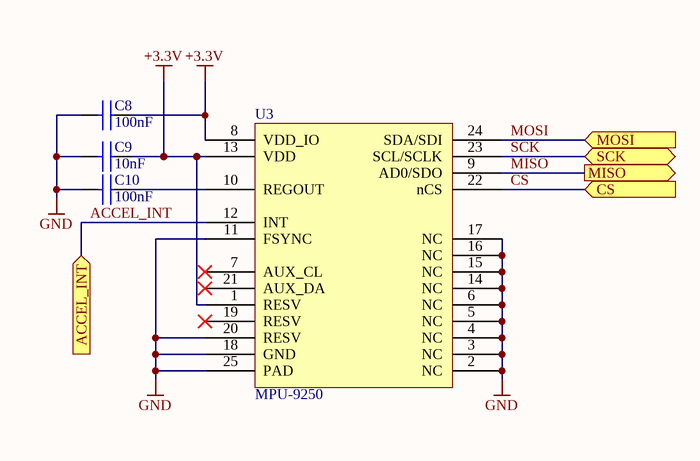
[diagram p4: ACCEL.SchDoc]

### Parts
C8  100nF  [CAP0603]
C9  10nF  [CAP0603]
C10  100nF  [CAP0603]
U3  MPU-9250  [QFN40P300X300X105_HS-25N]

### Ports
ACCEL_INT (in), CS (in), MISO (out), MOSI (in), SCK (bidir)

### Nets
+3.3V: C8.1 C9.1 U3.1(RESV) U3.8(VDD_IO) U3.13(VDD)
GND: C8.2 C9.2 C10.2 U3.2(NC) U3.3(NC) U3.4(NC) U3.5(NC) U3.6(NC) U3.11(FSYNC) U3.14(NC) U3.15(NC) U3.16(NC) U3.17(NC) U3.18(GND) U3.20(RESV) U3.25(PAD)
ACCEL_INT: U3.12(INT) ; port ACCEL_INT
CS: U3.22(nCS) ; port CS
MISO: U3.9(AD0/SDO) ; port MISO
MOSI: U3.24(SDA/SDI) ; port MOSI
SCK: U3.23(SCL/SCLK) ; port SCK
NetC10_1: C10.1 U3.10(REGOUT)

Not connected (* = marked no-connect by the designer): U3 7(AUX_CL)* 19(RESV)* 21(AUX_DA)*

### Notes on the sheet
- Size: A3
- Revision:
- Sheet
- of

### Library data of the parts
C8 C10 = C - 100nF: as C6 on sheet POWER; Supplier 1: Farnell; Manufacturer: MURATA; Manufacturer Part Number: GRM188R71C104KA01J; RoHS: YES; Stock 1: 18297; Pricing 1: 10=0.0145, 100=0.0126, 500=0.0081, 2500=0.0059, 5000=0.0052, 10000=0.0046, 50000=0.0036, 100000=0.0035 (GBP); Packaging: Cut Tape; Operating Temperature Min: -55; Operating Temperature Max: 125; Automotive Qualification Standard: -; MSL: MSL 1 - Unlimited; ComponentLink1URL: http://www.farnell.com/datasheets/2189124.pdf; ComponentLink1Description: http://www.farnell.com/datasheets/2189124.pdf; Supplier Part Number 1: 2688519
C9 = C - 10nF: KEMET - C0603X103K5RECAUTO - CAP, MLCC, AEC-Q200, X7R, 0.01UF, 50V; Manufacturer: TDK EPCOS; IRNAS Part No.: I-200004; Supplier 1: Farnell; Manufacturer Part Number: C0603X103K5RECAUTO; Stock 1: 307350; Pricing 1: 10=0.133, 100=0.0731, 500=0.055, 1000=0.0465, 2000=0.0408, 4000=0.0336, 20000=0.0295 (GBP); ComponentLink1URL: http://www.farnell.com/datasheets/2290180.pdf; ComponentLink1Description: http://www.farnell.com/datasheets/2290180.pdf; Supplier Part Number 1: 2760492
U3 = SEN - MPU-9250: IMU ACCEL/GYRO/MAG I2C/SPI 24QFN; Manufacturer: TDK InvenSense; Interface: I2C; Sensor Type: Accelerometer; Max Supply Voltage: 3.6V; Min Supply Voltage: 2.4V; Output Type: SPI; Manufacturer Part Number: MPU-9250; Stock 1: 0; RoHS: Yes; Mount: Surface Mount; Case/Package: QFN; Number of Pins: 24; Min Operating Temperature: -40°C; Max Operating Temperature: 85°C; Package Quantity: 1; Length: 3.1mm; Height: 1mm; Width: 3.1mm; ComponentLink1URL: https://datasheet.ciiva.com/29175/mpu-9250-29175105.pdf?src-supplier=Digi-Key; ComponentLink1Description: https://datasheet.ciiva.com/29175/mpu-9250-29175105.pdf?src-supplier=Digi-Key; Supplier 1: RSComponents; Supplier Part Number 1: 883-7942P; Supplier 2: Mouser; Supplier Part Number 2: 410-MPU-9250

## Nets that join several sheets
+3.3V: MAIN (CON1.1 CON1.17), RS485 (C7.2 R5.2 U2.8), UART_MUX (11 pins), ACCEL (5 pins)
+5V: MAIN (CON1.2 CON1.4 CON2.1), POWER (6 pins), UART_MUX (R14.2 R16.2 R18.2 R20.2)
+9V: MAIN (P1.1 P2.1), POWER (6 pins)
GND: MAIN (11 pins), POWER (11 pins), RS485 (5 pins), UART_MUX (C11.1 C12.1 U4.7 U4.8), ACCEL (16 pins)
A: MAIN (P1.2 P2.2), RS485 (D1.2 R8.1 R9.2)
ACCEL_INT: MAIN (CON1.31), ACCEL (U3.12)
B: MAIN (P1.3 P2.3), RS485 (D1.1 R6.2 R8.2)
BOOST_EN: MAIN (CON1.24), POWER (R3.1 U1.14)
CS: MAIN (CON1.29), ACCEL (U3.22)
DRIVER_EN: MAIN (CON1.22), RS485 (R7.2)
MISO: MAIN (CON1.21), ACCEL (U3.9)
MOSI: MAIN (CON1.19), ACCEL (U3.24)
RS485_RX: RS485 (U2.1), UART_MUX (R14.1 R21.2 T2.3)
RS485_TX: RS485 (R10.2 U2.4), UART_MUX (R16.1 R22.2 T3.3)
RX2: MAIN (CON2.2), UART_MUX (R18.1 R23.2 T4.3)
SCK: MAIN (CON1.23), ACCEL (U3.23)
TX2: MAIN (CON2.3), UART_MUX (R20.1 R24.2 T5.3)
UART_INH: MAIN (CON1.18), UART_MUX (U4.6)
UART_RX: MAIN (CON1.10), UART_MUX (U4.3)
UART_SEL_A: MAIN (CON1.16), UART_MUX (U4.10)
UART_SEL_B: MAIN (CON1.12), UART_MUX (U4.9)
UART_TX: MAIN (CON1.8), UART_MUX (U4.13)

## Assembly variants
BASIC: not fitted R7 R13 R14 R15 R16 R23 R24 T2 T2 T3 T3